# Altium schematic sheet [10]-FLASH,SD.SchDoc: S32K1_CONTROLLER
size A3; SheetNumber: 10; SheetTotal: 11
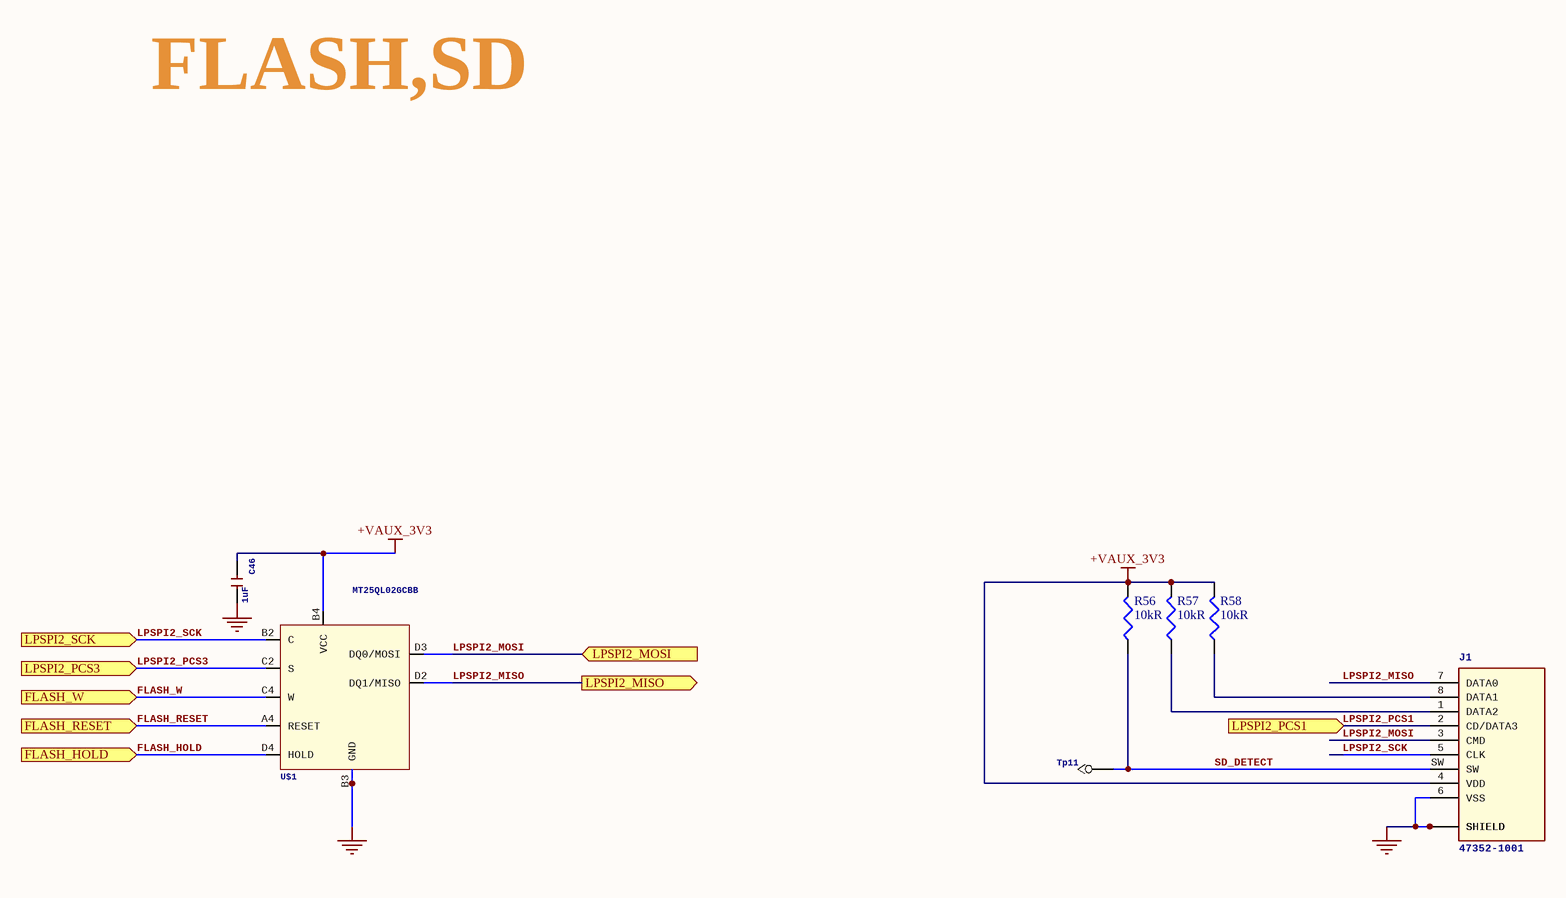
[diagram p0: [10]-FLASH,SD.SchDoc]

## Parts
C46  1uF  [C0805]
J1  47352-1001  [MOLEX_47352-1001]
R56  Resistance: 10kR  [RES0402]  (hidden comment: ERJ-2GEJ103X)
R57  Resistance: 10kR  [RES0402]  (hidden comment: ERJ-2GEJ103X)
R58  Resistance: 10kR  [RES0402]  (hidden comment: ERJ-2GEJ103X)
Tp11  TP  [TestPoint]  (value not drawn)
U$1  MT25QL02GCBB  [BGA24C100P5X5_600X800X155]

## Ports
FLASH_HOLD (in), FLASH_RESET (in), FLASH_W (in), LPSPI2_MISO (out), LPSPI2_MOSI (in), LPSPI2_PCS1 (in), LPSPI2_PCS3 (in), LPSPI2_SCK (in)

## Nets
+VAUX_3V3: C46.1 J1.4(VDD) R56.2 R57.2 R58.2 U$1.B4(VCC)
GND: C46.2 J1.6(VSS) J1.S1(SHIELD) J1.S2(SHIELD) J1.S3(SHIELD) J1.S4(SHIELD) U$1.B3(GND)
FLASH_HOLD: U$1.D4(HOLD) ; port FLASH_HOLD
FLASH_RESET: U$1.A4(RESET) ; port FLASH_RESET
FLASH_W: U$1.C4(W) ; port FLASH_W
LPSPI2_MISO: J1.7(DATA0) U$1.D2(DQ1/MISO) ; port LPSPI2_MISO
LPSPI2_MOSI: J1.3(CMD) U$1.D3(DQ0/MOSI) ; port LPSPI2_MOSI
LPSPI2_PCS1: J1.2(CD/DATA3) ; port LPSPI2_PCS1
LPSPI2_PCS3: U$1.C2(S) ; port LPSPI2_PCS3
LPSPI2_SCK: J1.5(CLK) U$1.B2(C) ; port LPSPI2_SCK
SD_DETECT: J1.SW R56.1 Tp11.1
NetJ1_1: J1.1(DATA2) R57.1
NetJ1_8: J1.8(DATA1) R58.1

## Notes on the sheet
- FLASH,SD
- Labels drawn without touching a wire or pin: LPSPI2_PCS1
- Title
- Size:
- Date:
- A3
- Number:
- Time:
- Revision:
- Sheet
- of
- File:

## Library data of the parts
C46 = CERAMIC-100NF-50V-10%-X7R(0805): 302010165; MPN: CC0805KRX7R9BB104; GateName_1: G$1; SymbolName_1: C; LibraryName: Seeed-Capacitor; DeviceSetName: CERAMIC-100NF-50V-10%-X7R(0805)
J1 = 47352-1001: 1.10mm Pitch microSD Card Connector, Push-Push Type, with VSS (Supply Voltage Ground) Detect Switch, Lead-Free; GateName_1: G$1; MF: Molex; SymbolName_1: 47352-1001; LibraryName: 47352-1001; DeviceSetName: 47352-1001; AVAILABILITY: Unavailable; MP: 47352-1001; PACKAGE: None; PRICE: None
R56-R58 = ERJ-2GEJ103X: Res Thick Film 0402 10K Ohm 5% 1/10W ±200ppm/°C Molded SMD SMD Punched Carrier T/R; Manufacturer: Panasonic; Power Rating: 100mW; Voltage Rating: 50V; Supplier 1: Digi-Key; Manufacturer Part Number: ERJ-2GEJ103X; Stock 1: 15334974; Pricing 1: 1 = 0.10000, 10 = 0.03100, 100 = 0.01250, 1000 = 0.00560, 2500 = 0.00486, 5000 = 0.00401 (USD); Mount: Surface Mount; Case/Package: 0402; Case Code (Metric): 1005; Case Code (Imperial): 0402; Contact Plating: Tin; Min Operating Temperature: -55°C; Max Operating Temperature: 155°C; Packaging: Cut Tape; Tolerance: 5%; Package Quantity: 1; Composition: Thick Film; Number of Terminations: 2; Termination: SMD/SMT; Military Standard: Not; Temperature Coefficient: 200ppm/°C; Max Power Dissipation: 100mW; Voltage Rating (DC): 50V; Features: Automotive AEC-Q200; Length: 1mm; Height: 0.35mm; Width: 0.02inch; Depth: 0.5mm; Radiation Hardening: No; REACH SVHC: No SVHC; Lead Free: Lead Free; ComponentLink1URL: http://industrial.panasonic.com/www-data/pdf/AOA0000/AOA0000CE1.pdf?src-supplier=Avnet+Europe; ComponentLink1Description: http://industrial.panasonic.com/www-data/pdf/AOA0000/AOA0000CE1.pdf?src-supplier=Avnet+Europe; ComponentLink2URL: http://www.farnell.com/datasheets/1678796.pdf?src-supplier=Element14; ComponentLink2Description: http://www.farnell.com/datasheets/1678796.pdf?src-supplier=Element14; ComponentLink3URL: http://www.mouser.com/ds/2/315/AOA0000CE1-37422.pdf?src-supplier=Mouser; ComponentLink3Description: http://www.mouser.com/ds/2/315/AOA0000CE1-37422.pdf?src-supplier=Mouser; ComponentLink4URL: http://www.farnell.com/datasheets/2059623.pdf?src-supplier=Farnell; ComponentLink4Description: http://www.farnell.com/datasheets/2059623.pdf?src-supplier=Farnell; ComponentLink5URL: https://www.alliedelec.com/m/d/51cd0790071e1666bdb9d00c57fcf960.pdf?src-supplier=Allied+Electronics; ComponentLink5Description: https://www.alliedelec.com/m/d/51cd0790071e1666bdb9d00c57fcf960.pdf?src-supplier=Allied+Electronics; ComponentLink6URL: http://www.jameco.com/Jameco/Products/ProdDS/1935721.pdf?src-supplier=Jameco; ComponentLink6Description: http://www.jameco.com/Jameco/Products/ProdDS/1935721.pdf?src-supplier=Jameco; ComponentLink7URL: http://industrial.panasonic.com/www-data/pdf/AOA0000/AOA0000CE1.pdf?src-supplier=Avnet; ComponentLink7Description: http://industrial.panasonic.com/www-data/pdf/AOA0000/AOA0000CE1.pdf?src-supplier=Avnet; ComponentLink8URL: http://datasheet.octopart.com/ERJ-2GEJ103X-Panasonic-datasheet-13266872.pdf?src-supplier=Newark; ComponentLink8Description: http://datasheet.octopart.com/ERJ-2GEJ103X-Panasonic-datasheet-13266872.pdf?src-supplier=Newark; ComponentLink9URL: http://datasheet.octopart.com/ERJ-2GEJ103X-Panasonic-datasheet-61114972.pdf?src-supplier=Farnell; ComponentLink9Description: http://datasheet.octopart.com/ERJ-2GEJ103X-Panasonic-datasheet-61114972.pdf?src-supplier=Farnell; ComponentLink10URL: http://datasheet.octopart.com/ERJ-2GEJ103X-Panasonic-datasheet-5314550.pdf?src-supplier=Element14; ComponentLink10Description: http://datasheet.octopart.com/ERJ-2GEJ103X-Panasonic-datasheet-5314550.pdf?src-supplier=Element14; ComponentLink11URL: http://datasheet.octopart.com/ERJ-2GEJ103X-Panasonic-datasheet-78375410.pdf; ComponentLink11Description: http://datasheet.octopart.com/ERJ-2GEJ103X-Panasonic-datasheet-78375410.pdf; ComponentLink12URL: http://datasheet.octopart.com/ERJ-2GEJ103X-Panasonic-datasheet-17720667.pdf?src-supplier=Jameco; ComponentLink12Description: http://datasheet.octopart.com/ERJ-2GEJ103X-Panasonic-datasheet-17720667.pdf?src-supplier=Jameco; ComponentLink13URL: http://datasheet.octopart.com/ERJ-2GEJ103X-Panasonic-datasheet-37173568.pdf?src-supplier=Electro+Sonic; ComponentLink13Description: http://datasheet.octopart.com/ERJ-2GEJ103X-Panasonic-datasheet-37173568.pdf?src-supplier=Electro+Sonic; ComponentLink14URL: http://datasheet.octopart.com/ERJ-2GEJ103X-Panasonic-datasheet-118598.pdf?src-supplier=Digi-Key; ComponentLink14Description: http://datasheet.octopart.com/ERJ-2GEJ103X-Panasonic-datasheet-118598.pdf?src-supplier=Digi-Key; ComponentLink15URL: http://datasheet.octopart.com/ERJ-2GEJ103X-Panasonic-datasheet-5313456.pdf?src-supplier=Farnell; ComponentLink15Description: http://datasheet.octopart.com/ERJ-2GEJ103X-Panasonic-datasheet-5313456.pdf?src-supplier=Farnell; ComponentLink16URL: http://datasheet.octopart.com/ERJ-2GEJ103X-Panasonic-datasheet-10554283.pdf?src-supplier=Farnell; ComponentLink16Description: http://datasheet.octopart.com/ERJ-2GEJ103X-Panasonic-datasheet-10554283.pdf?src-supplier=Farnell; ComponentLink17URL: http://datasheet.octopart.com/ERJ-2GEJ103X-Panasonic-datasheet-11480398.pdf?src-supplier=Arrow; ComponentLink17Description: http://datasheet.octopart.com/ERJ-2GEJ103X-Panasonic-datasheet-11480398.pdf?src-supplier=Arrow; ComponentLink18URL: http://datasheet.octopart.com/ERJ-2GEJ103X-Panasonic---ECG-datasheet-15994758.pdf?src-supplier=Farnell; ComponentLink18Description: http://datasheet.octopart.com/ERJ-2GEJ103X-Panasonic---ECG-datasheet-15994758.pdf?src-supplier=Farnell; ComponentLink19URL: http://datasheet.octopart.com/ERJ2GEJ103X-Panasonic-datasheet-27908757.pdf?src-supplier=Electro+Sonic; ComponentLink19Description: http://datasheet.octopart.com/ERJ2GEJ103X-Panasonic-datasheet-27908757.pdf?src-supplier=Electro+Sonic; ComponentLink20URL: http://datasheet.octopart.com/Thick-Film-Chip-Resistors-Panasonic-datasheet-family-105.pdf; ComponentLink20Description: http://datasheet.octopart.com/Thick-Film-Chip-Resistors-Panasonic-datasheet-family-105.pdf; Supplier Part Number 1: P10KJCT-ND
Tp11 = TP: GateName_1: G$1; TP?: >TP_NAME; SymbolName_1: TP; LibraryName: WeOnReferencePlatform; DeviceSetName: TP
U$1 = MT25QL02GCBB: GateName_1: G$1; SymbolName_1: MT25QL02GCBB; LibraryName: WeOnReferencePlatform; DeviceSetName: MT25QL02GCBB; MT25QL02GCBB8E12-0SIT: *